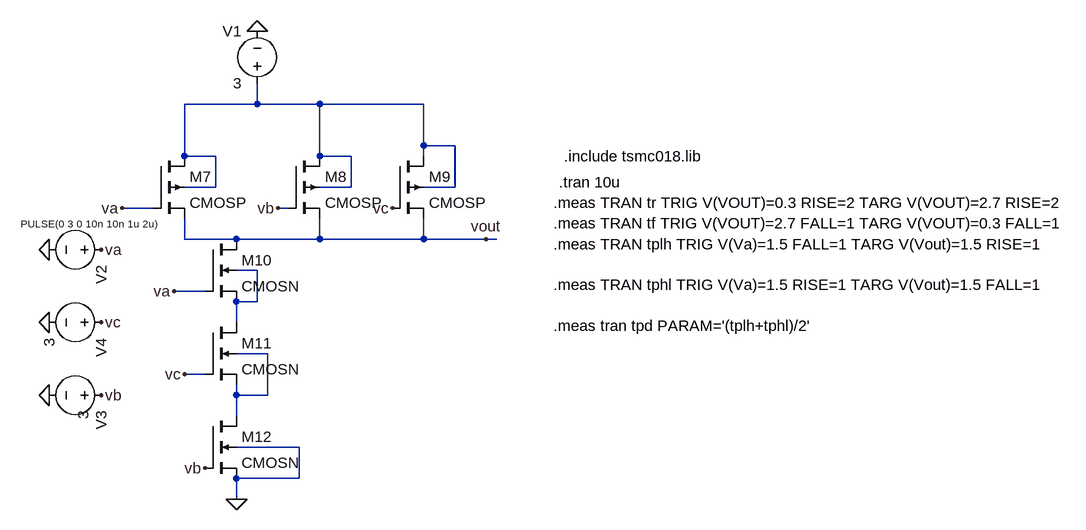
[diagram p0: schematic 3ip_NAND.asc]
3ip_NAND.asc, the LTspice schematic file:
Version 4
SHEET 1 1632 680
WIRE 144 -368 144 -400
WIRE 144 -368 32 -368
WIRE 240 -368 144 -368
WIRE 400 -368 240 -368
WIRE 400 -304 400 -368
WIRE 448 -304 400 -304
WIRE 32 -288 32 -368
WIRE 80 -288 32 -288
WIRE 240 -288 240 -368
WIRE 288 -288 240 -288
WIRE 400 -288 400 -304
WIRE 80 -240 80 -288
WIRE 80 -240 32 -240
WIRE 288 -240 288 -288
WIRE 288 -240 240 -240
WIRE 448 -240 448 -304
WIRE 448 -240 400 -240
WIRE -16 -208 -64 -208
WIRE 192 -208 176 -208
WIRE 32 -160 32 -192
WIRE 112 -160 32 -160
WIRE 240 -160 240 -192
WIRE 240 -160 112 -160
WIRE 400 -160 400 -192
WIRE 400 -160 240 -160
WIRE 496 -160 400 -160
WIRE 512 -160 496 -160
WIRE 144 -112 112 -112
WIRE 64 -80 16 -80
WIRE 144 -64 144 -112
WIRE 144 -64 112 -64
WIRE 112 -32 112 -64
WIRE 160 16 112 16
WIRE 64 48 32 48
WIRE 112 80 112 64
WIRE 160 80 160 16
WIRE 160 80 112 80
WIRE 112 112 112 80
WIRE 208 160 112 160
WIRE 208 208 208 160
WIRE 208 208 112 208
WIRE 112 240 112 208
FLAG 144 -480 0
FLAG -176 80 0
FLAG -176 -144 0
FLAG -96 -144 va
FLAG -64 -208 va
FLAG 16 -80 va
FLAG -96 80 vb
FLAG 176 -208 vb
FLAG 32 48 vc
FLAG 496 -160 vout
FLAG 112 240 0
FLAG -176 -32 0
FLAG -96 -32 vc
FLAG 64 192 vb
FLAG 352 -208 vc
SYMBOL voltage 144 -384 R180
WINDOW 0 24 96 Left 2
WINDOW 3 24 16 Left 2
WINDOW 123 0 0 Left 0
WINDOW 39 0 0 Left 0
SYMATTR InstName V1
SYMATTR Value 3
SYMBOL voltage -80 80 R90
WINDOW 3 24 44 Left 2
WINDOW 123 0 0 Left 0
WINDOW 39 0 0 Left 0
SYMATTR Value 3
SYMATTR InstName V3
SYMBOL voltage -80 -144 R90
WINDOW 3 -40 -67 VRight 1
WINDOW 123 0 0 Left 0
WINDOW 39 0 0 Left 0
SYMATTR Value PULSE(0 3 0 10n 10n 1u 2u)
SYMATTR InstName V2
SYMBOL voltage -80 -32 R90
WINDOW 123 0 0 Left 0
WINDOW 39 0 0 Left 0
SYMATTR InstName V4
SYMATTR Value 3
SYMBOL pmos4 -16 -288 R0
SYMATTR InstName M7
SYMATTR Value CMOSP
SYMATTR Value2 l=0.18u w=2u
SYMBOL pmos4 192 -288 R0
SYMATTR InstName M8
SYMATTR Value CMOSP
SYMATTR Value2 l=0.18u w=2u
SYMBOL pmos4 352 -288 R0
SYMATTR InstName M9
SYMATTR Value CMOSP
SYMATTR Value2 l=0.18u w=2u
SYMBOL nmos4 64 -160 R0
SYMATTR InstName M10
SYMATTR Value CMOSN
SYMATTR Value2 l=0.18u w=3u
SYMBOL nmos4 64 -32 R0
SYMATTR InstName M11
SYMATTR Value CMOSN
SYMATTR Value2 l=0.18u w=3u
SYMBOL nmos4 64 112 R0
SYMATTR InstName M12
SYMATTR Value CMOSN
SYMATTR Value2 l=0.18u w=3u
TEXT 608 -248 Left 2 !.tran 10u
TEXT 600 -216 Left 2 !.meas TRAN tr TRIG V(VOUT)=0.3 RISE=2 TARG V(VOUT)=2.7 RISE=2\n.meas TRAN tf TRIG V(VOUT)=2.7 FALL=1 TARG V(VOUT)=0.3 FALL=1
TEXT 616 -288 Left 2 !.include tsmc018.lib
TEXT 600 -152 Left 2 !.meas TRAN tplh TRIG V(Va)=1.5 FALL=1 TARG V(Vout)=1.5 RISE=1\n \n.meas TRAN tphl TRIG V(Va)=1.5 RISE=1 TARG V(Vout)=1.5 FALL=1\n \n.meas tran tpd PARAM='(tplh+tphl)/2'

The netlist it stands for:
* 3ip_NAND.asc
V1 N001 0 3
V3 vb 0 3
V2 va 0 PULSE(0 3 0 10n 10n 1u 2u)
V4 vc 0 3
M7 N001 va vout N001 CMOSP l=0.18u w=2u
M8 N001 vb vout N001 CMOSP l=0.18u w=2u
M9 N001 vc vout N001 CMOSP l=0.18u w=2u
M10 vout va N002 N002 CMOSN l=0.18u w=3u
M11 N002 vc N003 N003 CMOSN l=0.18u w=3u
M12 N003 vb 0 0 CMOSN l=0.18u w=3u
.model NMOS NMOS
.model PMOS PMOS
.lib standard.mos
.tran 10u
.meas TRAN tr TRIG V(VOUT)=0.3 RISE=2 TARG V(VOUT)=2.7 RISE=2
.meas TRAN tf TRIG V(VOUT)=2.7 FALL=1 TARG V(VOUT)=0.3 FALL=1
.include tsmc018.lib
.meas TRAN tplh TRIG V(Va)=1.5 FALL=1 TARG V(Vout)=1.5 RISE=1
.meas TRAN tphl TRIG V(Va)=1.5 RISE=1 TARG V(Vout)=1.5 FALL=1
.meas tran tpd PARAM='(tplh+tphl)/2'
.backanno
.end